# Altium schematic sheet Sheet1.SchDoc
size A; SheetNumber: 1; SheetTotal: 1; SPICEModelCacheNXKANVLF: <root> / <DocumentId>NXKANVLF</DocumentId> / <CacheFrame Number="0"> / <Model Name="tl082" Kind="CKT"> / <Text>*TL082 / *Dual WideBW JFETInput OpAmp pkg:DIP8 (A:3,2,8,4,1)(B:5,6,8,4,7) / * Connections: / *             Non-Inverting Input / *             |   Inverting Input / *             |   |   Positive Power Supply / *             |   |   |   Negative Power Supply / *             |   |   |   |   Output / *             |   |   |   |   | / .SUBCKT TL082 1   2   3   4   5 / C1   11 12 3.498E-12 / C2    6  7 15E-12 / DC    5 53 DX / DE   54  5 DX / DLP  90 91 DX / DLN  92 90 DX / DP    4  3 DX / BGND 99  0 V=V(3)*.5 + V(4)*.5 / BB    7 99 I=I(VB)*4.715E6 - I(VC)*5E6 + I(VE)*5E6 + / +              I(VLP)*5E6 - I(VLN)*5E6 / GA    6  0 11 12 282.8E-6 / GCM   0  6 10 99 8.942E-9 / ISS   3 10 DC 195E-6 / HLIM 90  0 VLIM 1K / J1   11  2 10 JX / J2   12  1 10 JX / R2    6  9 100E3 / RD1   4 11 3.536E3 / RD2   4 12 3.536E3 / RO1   8  5 150 / RO2   7 99 150 / RP    3  4 2.143E3 / RSS  10 99 1.026E6 / VB    9  0 DC 0 / VC    3 53 DC 2.2 / VE   54  4 DC 2.2 / VLIM  7  8 DC 0 / VLP  91  0 DC 25 / VLN   0 92 DC 25 / .MODEL DX D(IS=800E-18) / .MODEL JX PJF(IS=15E-12 BETA=270.1E-6 VTO=-1) / .ENDS TL082</Text> / </Model> / </CacheFrame> / </root>
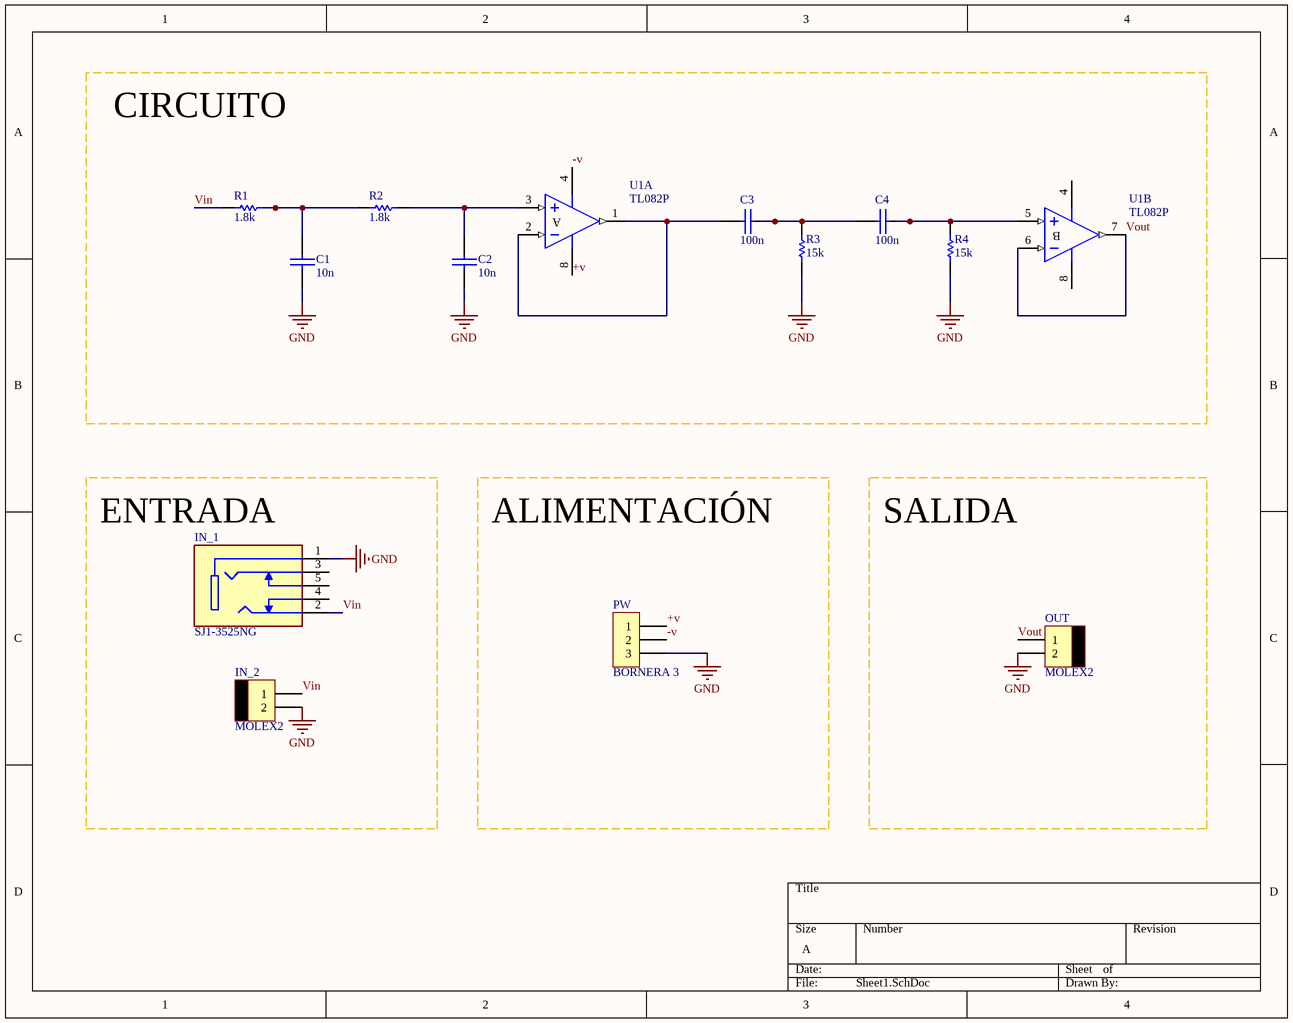
[diagram p0: Sheet1.SchDoc]

## Parts
C1  10n  [CAP200]
C2  10n  [CAP200]
C3  100n  [CAP200]
C4  100n  [CAP200]
IN_1  SJ1-3525NG  [CUI_SJ1-3525NG]
IN_2  MOLEX2  [MOLEX2]
OUT  MOLEX2  [MOLEX2]
PW  BORNERA 3  [BORNERA3]
R1  1.8k  [RES400]
R2  1.8k  [RES400]
R3  15k  [RES400]
R4  15k  [RES400]
U1  TL082P  [P008]  (parts A,B of 2)

## Blocks framed on the sheet
CIRCUITO: C1-C4 R1-R4 U1

## Nets
GND: C1.2 C2.2 IN_1.1 IN_2.2 OUT.2 PW.3 R3.1 R4.1
+v: PW.1 U1.8(V+)
-v: PW.2 U1.4(V-)
Vin: IN_1.2 IN_2.1 R1.1
Vout: OUT.1 U1.6(IN-) U1.7(OUT)
NetC1_1: C1.1 R1.2 R2.1
NetC2_1: C2.1 R2.2 U1.3(IN+)
NetC3_1: C3.1 U1.1(OUT) U1.2(IN-)
NetC3_2: C3.2 C4.1 R3.2
NetC4_2: C4.2 R4.2 U1.5(IN+)

Not connected (* = marked no-connect by the designer): IN_1 3 4 5

## Notes on the sheet
- (near IN_1) ENTRADA
- (near PW) ALIMENTACIÓN
- (near OUT) SALIDA
- (in symbol TL082P, part A) A
- (in symbol TL082P, part B) B

## Library data of the parts
C1-C4 = CAP
IN_1 = SJ1-3525NG: 3.5 mm, Stereo, Right Angle, Through Hole, Isolated Ground, 3 Conductors, 2 Internal Switches, Audio Jack Connector; MF: Same Sky; SnapEDA_Link: https://www.snapeda.com/parts/SJ1-3525NG/Same+Sky/view-part/?ref=snap; Package: None; Value: *; MP: SJ1-3525NG; Check_prices: https://www.snapeda.com/parts/SJ1-3525NG/Same+Sky/view-part/?ref=eda
R1-R4 = RES
U1 = TL082P: JFET-Input Operational Amplifier; Published: 16-Jan-2001; LatestRevisionDate: 04-Mar-2005; LatestRevisionNote: Stylized 3D Model Added.; DatasheetVersion: Feb-1999; PackageVersion: Jun-1999; PackageReference: P008; Publisher: Altium Limited; PackageDescription: DIP; 8 Leads; Row Spacing 7.62 mm; Pitch 2.54 mm; Code_JEDEC: MO-001-AN; ComponentLink1Description: Manufacturer Link; ComponentLink1URL: http://www.ti.com/; ComponentLink2Description: Datasheet; ComponentLink2URL: http://www-s.ti.com/sc/ds/tl082.pdf